# EAGLE design v2 (EAGLE 9.2.0)
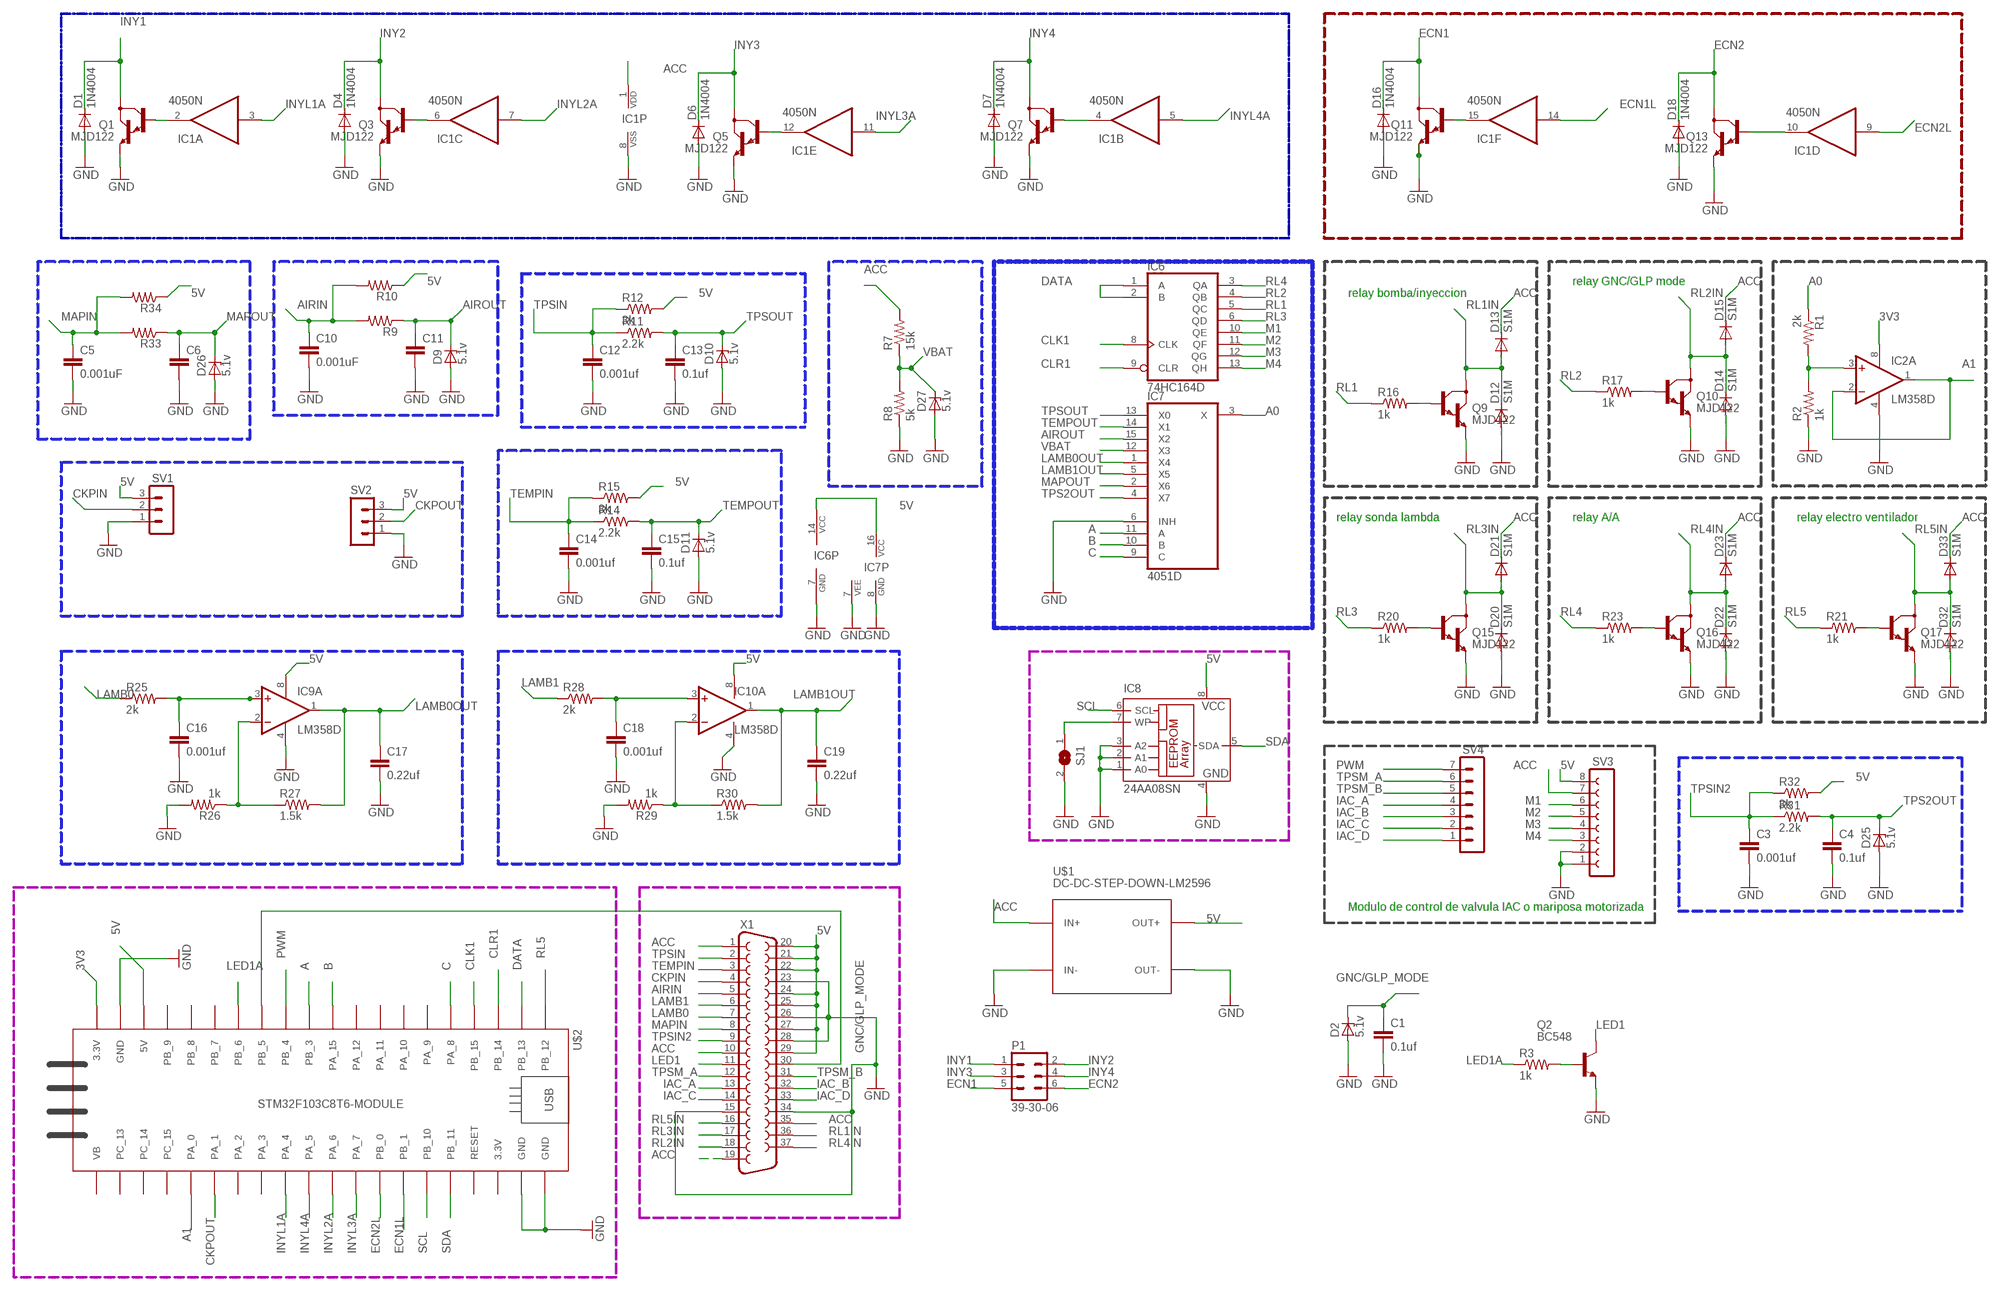
[diagram p0: schematic, sheet 1]

## Parts
C1  0.1uf  C-EU025-025X050  [C025-025X050]
C3  0.001uf  C-EU025-025X050  [C025-025X050]
C4  0.1uf  C-EU025-025X050  [C025-025X050]
C5  0.001uF  C-EU025-025X050  [C025-025X050]
C6  C-EU025-025X050  [C025-025X050]
C10  0.001uF  C-EU025-025X050  [C025-025X050]
C11  C-EU025-025X050  [C025-025X050]
C12  0.001uf  C-EU025-025X050  [C025-025X050]
C13  0.1uf  C-EU025-025X050  [C025-025X050]
C14  0.001uf  C-EU025-025X050  [C025-025X050]
C15  0.1uf  C-EU025-025X050  [C025-025X050]
C16  0.001uf  C-EU025-025X050  [C025-025X050]
C17  0.22uf  C-EU025-025X050  [C025-025X050]
C18  0.001uf  C-EU025-025X050  [C025-025X050]
C19  0.22uf  C-EU025-025X050  [C025-025X050]
D1  1N4004  [DO41-10]
D2  5.1v  ZENER-DIODEZD-5  [ZDIO-5]
D4  1N4004  [DO41-10]
D6  1N4004  [DO41-10]
D7  1N4004  [DO41-10]
D9  5.1v  ZENER-DIODEZD-5  [ZDIO-5]
D10  5.1v  ZENER-DIODEZD-5  [ZDIO-5]
D11  5.1v  ZENER-DIODEZD-5  [ZDIO-5]
D12  S1M  [SMA]
D13  S1M  [SMA]
D14  S1M  [SMA]
D15  S1M  [SMA]
D16  1N4004  [DO41-10]
D18  1N4004  [DO41-10]
D20  S1M  [SMA]
D21  S1M  [SMA]
D22  S1M  [SMA]
D23  S1M  [SMA]
D25  5.1v  ZENER-DIODEZD-5  [ZDIO-5]
D26  5.1v  ZENER-DIODEZD-5  [ZDIO-5]
D27  5.1v  ZENER-DIODEZD-5  [ZDIO-5]
D32  S1M  [SMA]
D33  S1M  [SMA]
IC1  4050N  [DIL16]
IC2  LM358D  [SO08]
IC6  74HC164D  [SO14]
IC7  4051D  [SO16]
IC8  24AA08SN  [SO-08]
IC9  LM358D  [SO08]
IC10  LM358D  [SO08]
P1  39-30-06  [39-30-?06?]
Q1  MJD122  [DPAK]
Q2  BC548  [TO92-EBC]
Q3  MJD122  [DPAK]
Q5  MJD122  [DPAK]
Q7  MJD122  [DPAK]
Q9  MJD122  [DPAK]
Q10  MJD122  [DPAK]
Q11  MJD122  [DPAK]
Q13  MJD122  [DPAK]
Q15  MJD122  [DPAK]
Q16  MJD122  [DPAK]
Q17  MJD122  [DPAK]
R1  2k  R-US_0204/5  [0204/5]
R2  1k  R-US_0204/5  [0204/5]
R3  1k  R-US_0204/5  [0204/5]
R7  15k  R-US_0204/5  [0204/5]
R8  5k  R-US_0204/5  [0204/5]
R9  R-US_0204/5  [0204/5]
R10  R-US_0204/5  [0204/5]
R11  2.2k  R-US_0204/5  [0204/5]
R12  3k  R-US_0204/5  [0204/5]
R14  2.2k  R-US_0204/5  [0204/5]
R15  3k  R-US_0204/5  [0204/5]
R16  1k  R-US_0204/5  [0204/5]
R17  1k  R-US_0204/5  [0204/5]
R20  1k  R-US_0204/5  [0204/5]
R21  1k  R-US_0204/5  [0204/5]
R23  1k  R-US_0204/5  [0204/5]
R25  2k  R-US_0204/5  [0204/5]
R26  1k  R-US_0204/5  [0204/5]
R27  1.5k  R-US_0204/5  [0204/5]
R28  2k  R-US_0204/5  [0204/5]
R29  1k  R-US_0204/5  [0204/5]
R30  1.5k  R-US_0204/5  [0204/5]
R31  2.2k  R-US_0204/5  [0204/5]
R32  3k  R-US_0204/5  [0204/5]
R33  R-US_0204/5  [0204/5]
R34  R-US_0204/5  [0204/5]
SJ1  SJW  [SJW]
SV1  MA03-1  [MA03-1]
SV2  MA03-1  [MA03-1]
SV3  FE08-1  [FE08]
SV4  MA07-1  [MA07-1]
U$1  DC-DC-STEP-DOWN-LM2596  [DC-DC-STEP-DOWN-LM2596]
U$2  STM32F103C8T6-MODULE  [STM32F103C8T6-MODULE]
X1  F37HP  [F37HP]

## Nets
3V3: IC2.8(P:V+) U$2.3.3V_1(3.3V)
5V: IC6.14(VCC) IC7.16(VCC) IC8.8(VCC) IC9.8(P:V+) IC10.8(P:V+) R10.1 R12.2 R15.2 R32.2 R34.1 SV1.3 SV2.3 SV3.8 U$1.OUT+ U$2.5V X1.20 X1.21 X1.22 X1.24 X1.25 X1.27 X1.29
A: IC7.11(A) U$2.PB_3
A0: IC7.3(X) R1.1
A1: IC2.1(A:OUT) IC2.2(A:-IN) U$2.PA_0
ACC: D13.C D15.C D21.C D23.C D33.C IC1.1(P:VDD) R7.2 SV3.7 U$1.IN+ X1.1 X1.10 X1.19 X1.35
AIRIN: C10.1 R9.2 R10.2 X1.5
AIROUT: C11.1 D9.C IC7.15(X2) R9.1
B: IC7.10(B) U$2.PA_15
C: IC7.9(C) U$2.PA_8
CKPIN: SV1.2 X1.4
CKPOUT: SV2.2 U$2.PA_1
CLK1: IC6.8(CLK) U$2.PB_15
CLR1: IC6.9(CLR) U$2.PB_14
DATA: IC6.1(A) IC6.2(B) U$2.PB_13
ECN1: D16.C P1.5 Q11.4(C)
ECN1L: IC1.14(F:I) U$2.PB_1
ECN2: D18.C P1.6 Q13.4(C)
ECN2L: IC1.9(D:I) U$2.PB_0
GNC/GLP_MODE: C1.1 D2.C U$2.PB_5 X1.30
GND: C1.2 C3.2 C4.2 C5.2 C6.2 C10.2 C11.2 C12.2 C13.2 C14.2 C15.2 C16.2 C17.2 C18.2 C19.2 D1.A D2.A D4.A D6.A D7.A D9.A D10.A D11.A D12.A D14.A D16.A D18.A D20.A D22.A D25.A D26.A D27.A D32.A IC1.8(P:VSS) IC2.4(P:V-) IC6.7(GND) IC7.6(INH) IC7.7(VEE) IC7.8(GND) IC8.1(A0) IC8.2(A1) IC8.3(A2) IC8.4(GND) IC9.4(P:V-) IC10.4(P:V-) Q1.3(E) Q2.E Q3.3(E) Q5.3(E) Q7.3(E) Q9.3(E) Q10.3(E) Q11.3(E) Q13.3(E) Q15.3(E) Q16.3(E) Q17.3(E) R2.1 R8.1 R26.2 R29.2 SJ1.2 SV1.1 SV2.1 SV3.1 SV3.2 U$1.IN- U$1.OUT- U$2.GND_1(GND) U$2.GND_2(GND) U$2.GND_3(GND) X1.15 X1.23 X1.26 X1.28 X1.34
IAC_A: SV4.4 X1.13
IAC_B: SV4.3 X1.32
IAC_C: SV4.2 X1.14
IAC_D: SV4.1 X1.33
INY1: D1.C P1.1 Q1.4(C)
INY2: D4.C P1.2 Q3.4(C)
INY3: D6.C P1.3 Q5.4(C)
INY4: D7.C P1.4 Q7.4(C)
INYL1A: IC1.3(A:I) U$2.PA_4
INYL2A: IC1.7(C:I) U$2.PA_6
INYL3A: IC1.11(E:I) U$2.PA_7
INYL4A: IC1.5(B:I) U$2.PA_5
LAMB0: R25.1 X1.7
LAMB0OUT: C17.1 IC7.1(X4) IC9.1(A:OUT) R27.2
LAMB1: R28.1 X1.6
LAMB1OUT: C19.1 IC7.5(X5) IC10.1(A:OUT) R30.2
LED1: Q2.C X1.11
LED1A: R3.1 U$2.PB_6
M1: IC6.10(QE) SV3.6
M2: IC6.11(QF) SV3.5
M3: IC6.12(QG) SV3.4
M4: IC6.13(QH) SV3.3
MAPIN: C5.1 R33.2 R34.2 X1.8
MAPOUT: C6.1 D26.C IC7.2(X6) R33.1
N$1: C18.1 IC10.3(A:+IN) R28.2
N$2: IC1.2(A:O) Q1.1(B)
N$3: IC1.6(C:O) Q3.1(B)
N$4: Q9.1(B) R16.2
N$5: IC1.12(E:O) Q5.1(B)
N$6: IC1.4(B:O) Q7.1(B)
N$7: Q17.1(B) R21.2
N$8: Q10.1(B) R17.2
N$9: IC1.15(F:O) Q11.1(B)
N$10: IC1.10(D:O) Q13.1(B)
N$11: IC2.3(A:+IN) R1.2 R2.2
N$14: Q2.B R3.2
N$19: Q15.1(B) R20.2
N$29: Q16.1(B) R23.2
N$31: C16.1 IC9.3(A:+IN) R25.2
N$32: IC9.2(A:-IN) R26.1 R27.1
N$34: IC8.7(WP) SJ1.1
N$37: IC10.2(A:-IN) R29.1 R30.1
PWM: SV4.7 U$2.PB_4
RL1: IC6.5(QC) R16.1
RL1IN: D12.C D13.A Q9.4(C) X1.36
RL2: IC6.4(QB) R17.1
RL2IN: D14.C D15.A Q10.4(C) X1.18
RL3: IC6.6(QD) R20.1
RL3IN: D20.C D21.A Q15.4(C) X1.17
RL4: IC6.3(QA) R23.1
RL4IN: D22.C D23.A Q16.4(C) X1.37
RL5: R21.1 U$2.PB_12
RL5IN: D32.C D33.A Q17.4(C) X1.16
SCL: IC8.6(SCL) U$2.PB_10
SDA: IC8.5(SDA) U$2.PB_11
TEMPIN: C14.1 R14.1 R15.1 X1.3
TEMPOUT: C15.1 D11.C IC7.14(X1) R14.2
TPS2OUT: C4.1 D25.C IC7.4(X7) R31.2
TPSIN: C12.1 R11.1 R12.1 X1.2
TPSIN2: C3.1 R31.1 R32.1 X1.9
TPSM_A: SV4.6 X1.12
TPSM_B: SV4.5 X1.31
TPSOUT: C13.1 D10.C IC7.13(X0) R11.2
VBAT: D27.C IC7.12(X3) R7.1 R8.2
Unconnected: IC2.5(B:+IN) IC2.6(B:-IN) IC2.7(B:OUT) IC9.5(B:+IN) IC9.6(B:-IN) IC9.7(B:OUT) IC10.5(B:+IN) IC10.6(B:-IN) IC10.7(B:OUT) U$2.3.3V_2(3.3V) U$2.PA_2 U$2.PA_3 U$2.PA_9 U$2.PA_10 U$2.PA_11 U$2.PA_12 U$2.PB_7 U$2.PB_8 U$2.PB_9 U$2.PC_13 U$2.PC_14 U$2.PC_15 U$2.RESET U$2.VB

## Buses
B$1

## Notes on the sheet
- relay GNC/GLP mode
- relay bomba/inyeccion
- relay sonda lambda | relay A/A | relay electro ventilador
- Modulo de control de valvula IAC o mariposa motorizada

## Library data of the parts
C1 C3-C6 C10-C19 = rcl:C-EU: CAPACITOR, European symbol; SPICEPREFIX: C
D1 D4 D6 D7 D16 D18 = diode:1N4004: DIODE general purpose rectifier, 1 A
D2 D9-D11 D25-D27 = diode:ZENER-DIODE: Z-Diode
D12-D15 D20-D23 D32 D33 = diode:S1M
IC1 = 40xx:4050: Hex non-inverting BUFFER
IC2 IC9 IC10 = linear:LM358: OP AMP also LM158; LM258; LM2904 Source: http://cache.national.com/ds/LM/LM158.pdf
IC6 = 74xx-us:74*164: 8-bit parallel out SHIFT REGISTER
IC7 = 40xx:4051: 8-channel ANALOG MULTIPLEXER
IC8 = microchip:24*: Serial EEPROM I2C; MF: MICROCHIP; MPN: 24AA08-I/SN; OC_FARNELL: 1579568; OC_NEWARK: 92C6826
P1 = con-molex-mini-fit:39-30-?06?: HEADER
Q1 Q3 Q5 Q7 Q9-Q11 Q13 Q15-Q17 = MJD122:MJD122: TRANS DARL NPN 100V 5A DPAK; AVAILABILITY: Unavailable; MF: STMicroelectronics; MP: MJD122; PACKAGE: None; PRICE: None
Q2 = transistor-npn:BC548*: NPN Transistor
R1-R3 R7-R12 R14-R17 R20 R21 R23 R25-R34 = rcl:R-US_: RESISTOR, American symbol; SPICEPREFIX: R
SJ1 = jumper:SJ: SMD solder JUMPER
SV1 SV2 = con-lstb:MA03-1: PIN HEADER; OC_FARNELL: unknown; OC_NEWARK: unknown
SV3 = con-lsta:FE08-1: FEMALE HEADER; OC_FARNELL: unknown; OC_NEWARK: unknown
SV4 = con-lstb:MA07-1: PIN HEADER; OC_FARNELL: unknown; OC_NEWARK: unknown
U$1 = diy-modules:DC-DC-STEP-DOWN-LM2596: DC/DC Step-Down Regulator based on LM2596-ADJ chip LM2596 datasheet available here: http://www.ti.com/lit/ds/symlink/lm2596.pdf Click here to find device on ebay.com <http://www.ebay.com/sch/lm2596+power+regulator>
U$2 = stm32f103c8t6_module:STM32F103C8T6-MODULE: STM32F103C8T6 module with ARM Cortex-3, 20kB SRAM, 64kB Flash, 72MHz
X1 = con-subd:F37: SUB-D; OC_FARNELL: unknown; OC_NEWARK: unknown

## Board
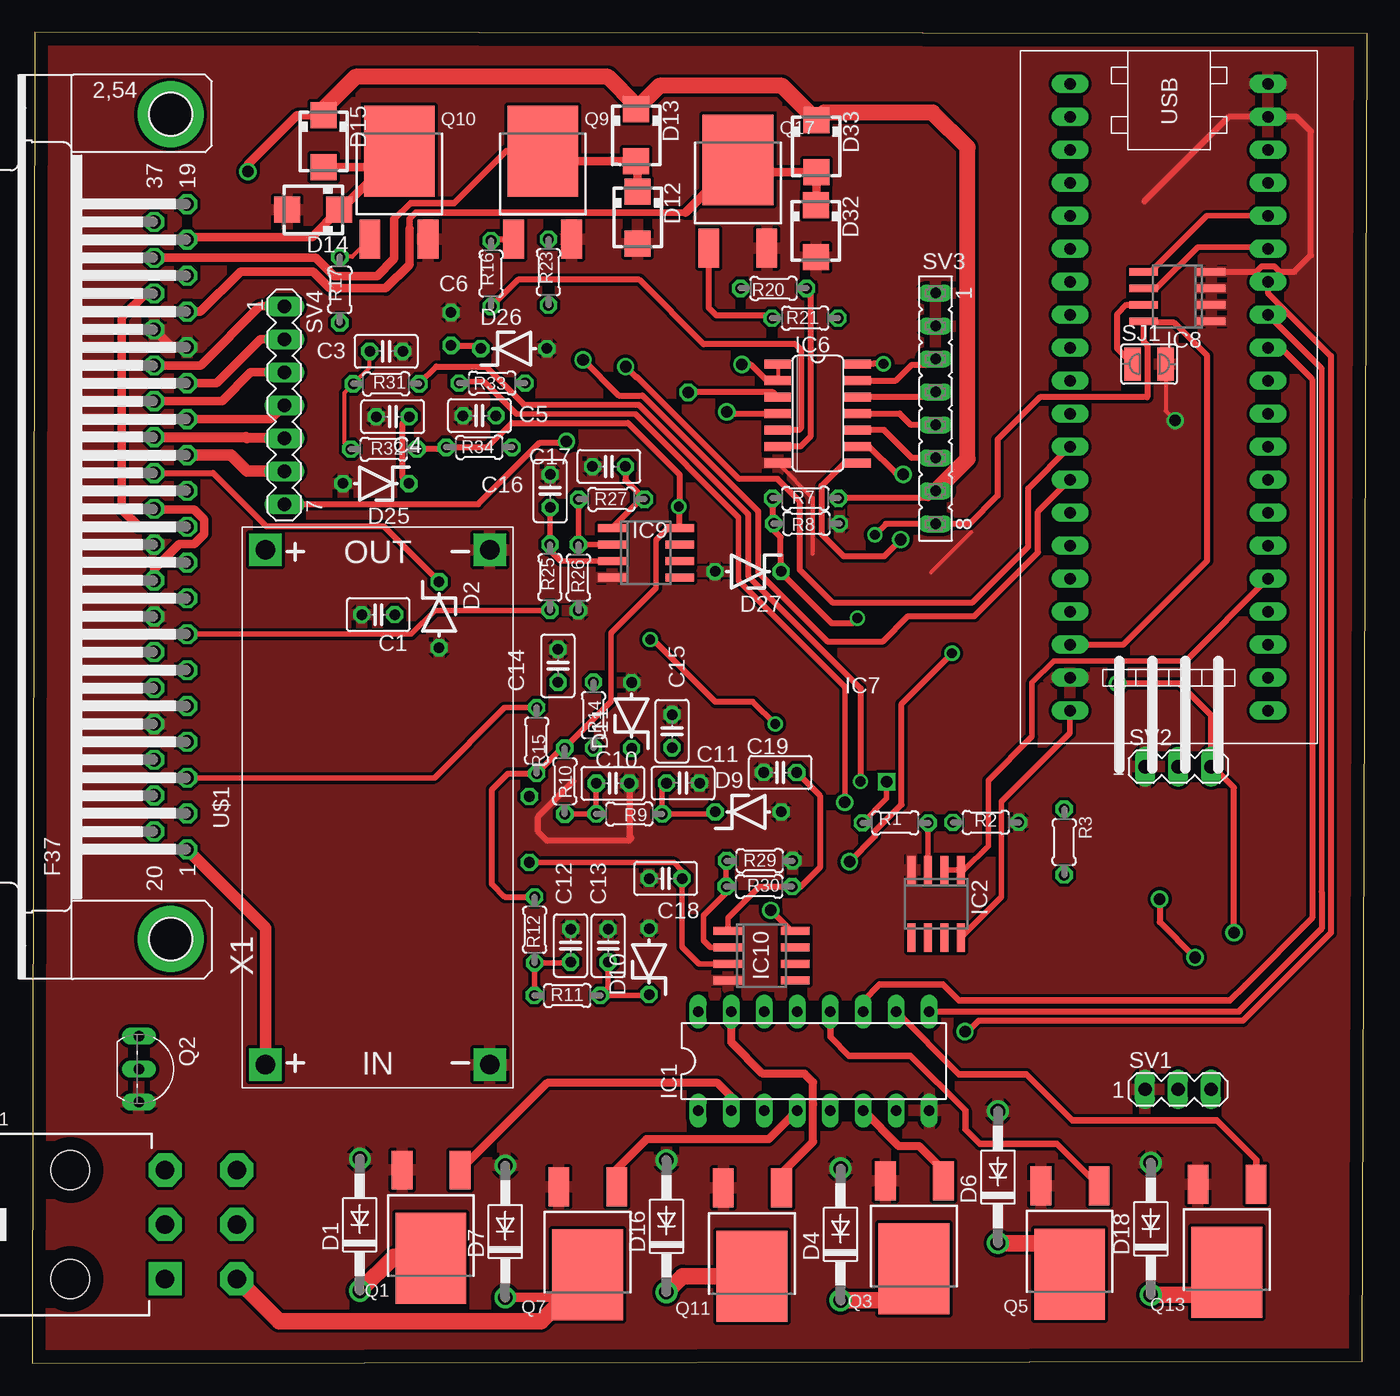
[diagram p1: board, top side]
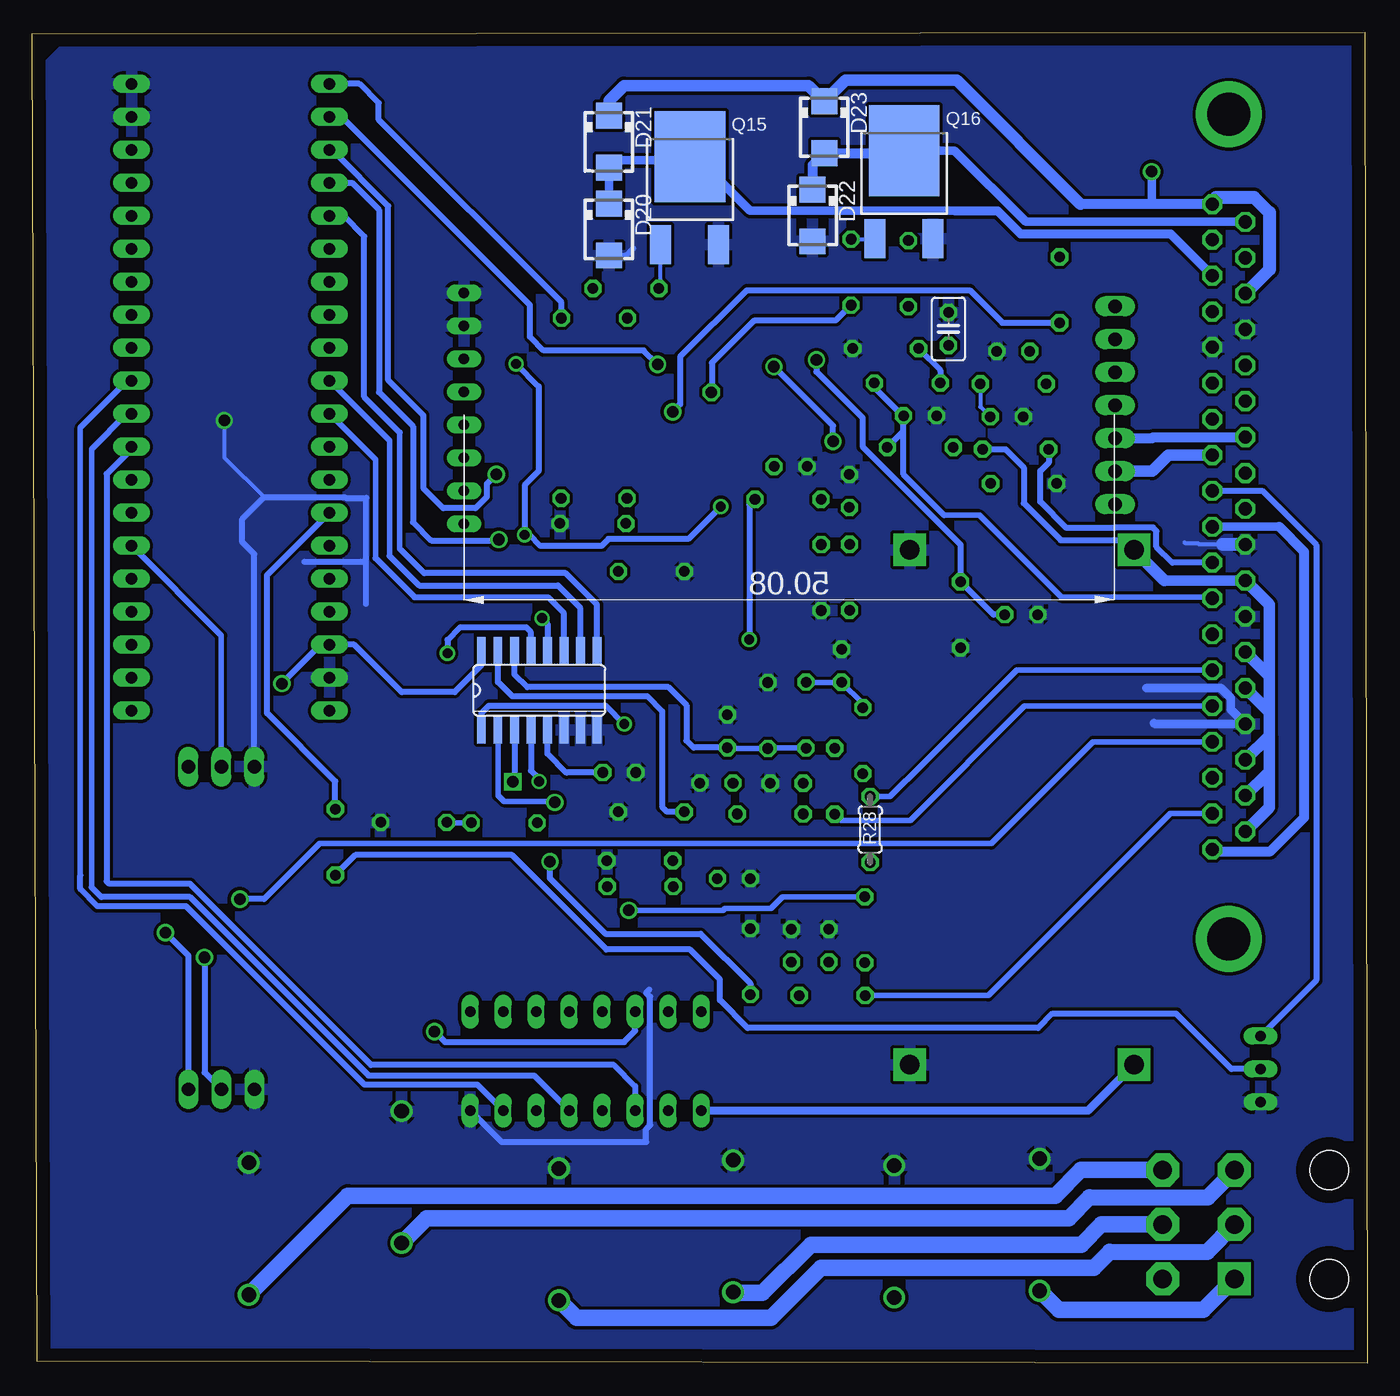
[diagram p2: board, bottom side, seen from below]

Size 102.75 x 102.47 mm. Coordinates in mm from the lower left corner, seen from the top.
Outline: 0,0 102.38,0.16 102.75,102.39 0.17,102.47 0,0
Copper layers (1*16): Top 0.035mm / dielectric 1.5mm / Bottom 0.035mm
Design rules "default *": minimum track width 12mil, minimum drill 0.35mm, track to track 10mil, track to pad 10mil, pad to pad 10mil, via to via 10mil, smd to smd 10mil, copper to edge 40mil, drill to drill 10mil, minimum pad ring 10mil, minimum via ring 8mil, stop-mask expansion 10mil, vias tented up to drill 0mil, thermal gap 10mil

### Footprints (pad centres in the part's own frame; a part is rotated, then mirrored left to right if it is on the bottom)
C025-025X050 = drill 0.813 octagon: 1 -1.27,0; 2 1.27,0
DO41-10 = drill 1.118: A 5.08,0; C -5.08,0
ZDIO-5 = drill 0.813 octagon: A 2.54,0; C -2.54,0
SMA = smd 2 x 2: A 2,0; C -2,0
DIL16 = drill 0.813 long: 1 -8.89,-3.81; 2 -6.35,-3.81; 3 -3.81,-3.81; 4 -1.27,-3.81; 5 1.27,-3.81; 6 3.81,-3.81; 7 6.35,-3.81; 8 8.89,-3.81; 9 8.89,3.81; 10 6.35,3.81; 11 3.81,3.81; 12 1.27,3.81; 13 -1.27,3.81; 14 -3.81,3.81; 15 -6.35,3.81; 16 -8.89,3.81
SO08 = smd 0.6 x 2.2: 1 -1.905,-2.6; 2 -0.635,-2.6; 3 0.635,-2.6; 4 1.905,-2.6; 5 1.905,2.6; 6 0.635,2.6; 7 -0.635,2.6; 8 -1.905,2.6
SO14 = smd 0.66 x 2.032: 1 -3.81,-3.073; 2 -2.54,-3.073; 3 -1.27,-3.073; 4 0,-3.073; 5 1.27,-3.073; 6 2.54,-3.073; 7 3.81,-3.073; 8 3.81,3.073; 9 2.54,3.073; 10 1.27,3.073; 11 0,3.073; 12 -1.27,3.073; 13 -2.54,3.073; 14 -3.81,3.073
SO16 = smd 0.66 x 2.032: 1 -4.445,-3.073; 2 -3.175,-3.073; 3 -1.905,-3.073; 4 -0.635,-3.073; 5 0.635,-3.073; 6 1.905,-3.073; 7 3.175,-3.073; 8 4.445,-3.073; 9 4.445,3.073; 10 3.175,3.073; 11 1.905,3.073; 12 0.635,3.073; 13 -0.635,3.073; 14 -1.905,3.073; 15 -3.175,3.073; 16 -4.445,3.073
SO-08 = smd 0.6 x 2.2: 1 -1.905,-2.6; 2 -0.635,-2.6; 3 0.635,-2.6; 4 1.905,-2.6; 5 1.905,2.6; 6 0.635,2.6; 7 -0.635,2.6; 8 -1.905,2.6
39-30-?06? = drill 1.422 pad 2.54 square: 1 4.191,0 | drill 1.422 pad 2.54 octagon: 2 0,0; 3 -4.191,0; 4 4.191,5.512; 5 0,5.512; 6 -4.191,5.512 | hole 3: -4.191,-7.3; 4.191,-7.3
DPAK = smd 1.6 x 2.997: 1 -2.261,-4.928; 3 2.21,-4.928 | smd 5.452 x 7: 4 0,1.853
TO92-EBC = drill 0.813 long: B 0,-1.27; C -2.54,-1.27; E 2.54,-1.27
0204/5 = drill 0.813 octagon: 1 -2.54,0; 2 2.54,0
SJW = smd 1.27 x 2.54: 1 -1.27,0; 2 1.27,0
MA03-1 = drill 1.016 long: 1 -2.54,0; 2 0,0; 3 2.54,0
FE08 = drill 0.813 long: 1 -8.89,0; 2 -6.35,0; 3 -3.81,0; 4 -1.27,0; 5 1.27,0; 6 3.81,0; 7 6.35,0; 8 8.89,0
MA07-1 = drill 1.016 long: 1 -7.62,0; 2 -5.08,0; 3 -2.54,0; 4 0,0; 5 2.54,0; 6 5.08,0; 7 7.62,0
DC-DC-STEP-DOWN-LM2596 = drill 1.5 pad 2.5 square: IN+ -19.812,8.636; IN- -19.812,-8.636; OUT+ 19.812,8.636; OUT- 19.812,-8.636
STM32F103C8T6-MODULE = drill 0.9 long: 3.3V_1 25.4,-7.62; 3.3V_2 -17.78,7.62; 5V 20.32,-7.62; GND_1 22.86,-7.62; GND_2 -20.32,7.62; GND_3 -22.86,7.62; PA_0 15.24,7.62; PA_1 12.7,7.62; PA_2 10.16,7.62; PA_3 7.62,7.62; PA_4 5.08,7.62; PA_5 2.54,7.62; PA_6 0,7.62; PA_7 -2.54,7.62; PA_8 -12.7,-7.62; PA_9 -10.16,-7.62; PA_10 -7.62,-7.62; PA_11 -5.08,-7.62; PA_12 -2.54,-7.62; PA_15 0,-7.62; PB_0 -5.08,7.62; PB_1 -7.62,7.62; PB_3 2.54,-7.62; PB_4 5.08,-7.62; PB_5 7.62,-7.62; PB_6 10.16,-7.62; PB_7 12.7,-7.62; PB_8 15.24,-7.62; PB_9 17.78,-7.62; PB_10 -10.16,7.62; PB_11 -12.7,7.62; PB_12 -22.86,-7.62; PB_13 -20.32,-7.62; PB_14 -17.78,-7.62; PB_15 -15.24,-7.62; PC_13 22.86,7.62; PC_14 20.32,7.62; PC_15 17.78,7.62; RESET -15.24,7.62; VB 25.4,7.62
F37HP = drill 1.016 octagon: 1 -24.841,-1.27; 2 -22.073,-1.27; 3 -19.329,-1.27; 4 -16.561,-1.27; 5 -13.792,-1.27; 6 -11.049,-1.27; 7 -8.28,-1.27; 8 -5.512,-1.27; 9 -2.769,-1.27; 10 0,-1.27; 11 2.769,-1.27; 12 5.512,-1.27; 13 8.28,-1.27; 14 11.049,-1.27; 15 13.818,-1.27; 16 16.561,-1.27; 17 19.329,-1.27; 18 22.098,-1.27; 19 24.841,-1.27; 20 -23.47,1.27; 21 -20.701,1.27; 22 -17.932,1.27; 23 -15.189,1.27; 24 -12.421,1.27; 25 -9.652,1.27; 26 -6.909,1.27; 27 -4.14,1.27; 28 -1.372,1.27; 29 1.372,1.27; 30 4.14,1.27; 31 6.909,1.27; 32 9.677,1.27; 33 12.421,1.27; 34 15.189,1.27; 35 17.958,1.27; 36 20.701,1.27; 37 23.47,1.27 | drill 3.302 pad 5.08: G1 -31.75,0; G2 31.75,0

### Placement (x,y rotation side)
C1  26.62,57.65 180 top
C3  27.23,77.92 0 top
C4  27.73,72.89 180 top
C5  34.42,72.97 180 top
C6  32.22,79.65 90 bottom
C10  44.68,44.67 0 top
C11  50.09,44.68 0 top
C12  41.43,32.17 90 top
C13  44.33,32.16 90 top
C14  40.46,53.71 90 top
C15  49.25,48.68 90 top
C16  39.86,67.17 90 top
C17  44.38,69.06 180 top
C18  48.75,37.34 180 top
C19  57.57,45.5 180 top
D1  25.2,10.67 90 top
D2  31.3,57.64 270 top
D4  62.21,9.94 90 top
D6  74.33,14.34 90 top
D7  36.4,10.16 90 top
D9  55.11,42.47 0 top
D10  47.48,30.94 90 top
D11  46.13,49.88 90 top
D12  46.6,88.22 270 top
D13  46.48,94.56 270 top
D14  21.62,88.81 180 top
D15  22.42,94.09 270 top
D16  48.81,10.56 90 top
D18  86.1,10.37 90 top
D20  58.37,87.31 270 bottom
D21  58.37,94.06 270 bottom
D22  42.69,88.38 270 bottom
D23  41.78,95.18 270 bottom
D25  26.44,67.74 180 top
D26  37.06,78.14 0 top
D27  55.1,60.97 180 top
D32  60.32,87.19 270 top
D33  60.36,93.71 270 top
IC1  60.15,23.28 0 top
IC2  69.58,35.39 180 top
IC6  60.46,73.13 270 top
IC7  63.73,51.83 0 bottom
IC8  88.14,82.13 90 top
IC9  47.23,62.41 270 top
IC10  56.13,31.39 270 top
P1  39-30-06?  [39-30-?06?]  10.21,10.69 270 top
Q1  30.67,9.96 180 top
Q2  9.46,22.67 270 top
Q3  67.87,9.12 180 top
Q5  79.85,8.73 180 top
Q7  42.73,8.68 180 top
Q9  39.3,91.49 0 top
Q10  28.24,91.48 0 top
Q11  55.4,8.58 180 top
Q13  91.95,8.87 180 top
Q15  52.13,91.06 0 bottom
Q16  35.63,91.51 0 bottom
Q17  54.32,90.8 0 top
R1  66.43,41.62 0 top
R2  73.4,41.65 180 top
R3  79.43,40.14 270 top
R7  59.51,66.61 0 top
R8  59.59,64.67 180 top
R9  45.95,42.3 180 top
R10  40.98,44.83 270 top
R11  41.18,28.33 0 top
R12  38.66,33.39 90 top
R14  43.19,49.92 270 top
R15  38.82,47.95 270 top
R16  35.31,83.91 90 top
R17  23.67,82.65 90 top
R20  57.06,82.77 180 top
R21  59.49,80.48 180 top
R23  39.73,84.02 90 top
R25  39.84,60.52 90 top
R26  42.02,60.51 270 top
R27  44.58,66.53 0 top
R28  38.26,41.11 270 bottom
R29  55.99,38.71 0 top
R30  55.95,36.72 0 top
R31  27.23,75.42 0 top
R32  27.05,70.39 0 top
R33  35.4,75.48 0 top
R34  34.4,70.53 0 top
SJ1  85.98,76.94 0 top
SV1  88.2,21.09 0 top
SV2  88.21,45.94 0 top
SV3  69.52,73.52 270 top
SV4  19.39,73.77 270 top
U$1  26.57,42.81 90 top
U$2  87.5,75.66 270 top
X1  10.64,64.42 90 top

### Tracks (layer width: path | path; a pad name or v marks a point on that pad's centre or on a via)
3V3
  Top 0.406: U$2.3.3V_1 79.88,48.53 74.61,43.26 74.61,35.91 IC2.8
5V  (via drill 0.76, 0.89)
  Top 0.406: R15.2 40.77,47.37 R10.1 44.56,50.95 44.56,56.22 48.02,59.68 48.02,63.39 48.95,64.32 IC9.8 | IC10.8 58.42,33.3 v56.84,34.88
  Top 0.457: R32.2 31.71,70.39 R34.1 35.05,70.53 36.92,72.4 45.85,72.4 49.83,68.43 49.83,65.9 | IC9.8 49.83,65.9 | 49.83,65.9 v49.75,65.97 | v65.52,76.96 64.74,76.96 64.72,76.94 IC6.14 | v64.86,63.8 65.7,64.63 SV3.8 72.12,64.63 74.31,66.81 74.31,71.15 77.55,74.39 85.83,74.39 85.83,78.41 85.54,78.7 85.54,80.13 | IC8.8 85.54,80.13 | U$2.5V 83.98,55.34 90.45,61.8 90.45,77.59 87.91,80.13 85.54,80.13 | SV2.3 90.75,46.08 | 90.75,46.08 90.75,49.88 88.28,52.34 v83.55,52.34 | v92.51,33.15 92.51,44.33 90.75,46.08 | R12.2 36.36,35.93 35.38,36.9 35.38,44.18 36.61,45.41 R15.2
  Top 0.635: X1.27 9.37,61.16 11.29,63.09 12.46,63.09 13.24,63.87 13.24,64.97 12.46,65.75 9.4,65.75 X1.29
  Bottom 0.406: R12.2 45,35.93 45.9,35.03 49.44,35.03 49.57,34.89 56.83,34.89 v56.84,34.88
  Bottom 0.457: R32.2 27.84,70.39 26.43,68.98 26.43,66.23 23.58,63.38 18.69,63.38 U$1.OUT+ | v65.52,76.96 63.77,75.21 63.77,68.71 64.86,67.61 v64.86,63.8 64.48,63.8 63.65,62.96 58.91,62.96 58.4,63.48 52.25,63.48 v49.75,65.97 | IC7.16 68.17,53.76 70.25,51.69 74.32,51.69 77.97,55.34 U$2.5V 80.55,55.34 v83.55,52.34 | SV1.3 90.74,31.39 v92.51,33.15
  Bottom 0.813: 15.59,60.28 X1.27
  Bottom 0.889: 15.59,60.28 U$1.OUT+ | X1.22 7.53,48.32 | 7.53,50.16 X1.24 | 7.53,48.32 7.53,50.16 | 7.53,50.16 7.53,52.93 | 7.53,52.93 X1.25 | 7.53,48.32 7.53,45.55 | 7.53,45.55 X1.21 | 7.53,45.55 7.53,42.79 X1.20 | 7.53,52.93 7.53,58.44 X1.27
A
  Bottom 0.406: U$2.PB_3 76.34,69.57 76.34,62
  Bottom 0.457: IC7.11 61.82,57.76 63.07,59 73.34,59 76.34,62
A0  (via drill 0.89)
  Top 0.406: R1.1 65.76,43.49 v65.76,44.78
  Bottom 0.457: v65.76,44.78 65.63,44.91 IC7.3
A1
  Top 0.406: IC2.2 IC2.1 71.73,37.99 73.58,39.84 73.58,44.89 76.96,48.26 76.96,52.42 78.63,54.09 88.79,54.09 U$2.PA_0
ACC  (via drill 0.89)
  Top 0.457: SV3.7 68.96,66.61 R7.2
  Top 0.635: D15.C 20.4,96.09 16.58,92.28 v16.58,91.76 | X1.35 8.72,82.38 6.88,80.54 6.88,65.76 8.21,64.42 X1.10
  Top 0.889: X1.1 17.94,33.54 U$1.IN+
  Top 1.219: D15.C 22.42,96.59 24.87,99.05 44.31,99.05 46.48,96.88 D13.C 48.28,98.36 57.71,98.36 D33.C 60.95,96.31 69.3,96.31 71.98,93.63 71.98,69.63 SV3.7
  Bottom 0.457: X1.19 11.62,89.55 11.62,89.79
  Bottom 0.61: IC1.1 21.47,19.47 U$1.IN+
  Bottom 0.635: 11.75,39.42 X1.1 | v16.58,91.76 16.58,89.3 16.62,89.26 | 6.77,64.42 X1.10
  Bottom 0.762: X1.19 16.62,89.26 22.05,89.26 | 11.75,39.42 7.43,39.42 4.83,42.02 4.83,62.48 6.77,64.42
  Bottom 0.889: D21.C 58.37,97.23 57.21,98.39 42.99,98.39 D23.C 40.17,98.79 31.59,98.79 22.05,89.26
  Bottom 1.016: 11.62,89.79 8.71,89.79 7.52,88.6 7.52,84.22 X1.35
AIRIN
  Top 0.406: R10.2 43.39,42.29 R9.2 C10.1
  Bottom 0.406: X1.5 26.37,50.63 35.17,41.82 40.51,41.82 R10.2
AIROUT
  Top 0.406: C11.1 48.49,44.35 R9.1 52.4,42.3 D9.C
  Bottom 0.457: IC7.15 66.9,52.45 65.8,51.35 55.4,51.35 54.26,50.21 54.26,42.85 53.89,42.47 D9.C
B
  Bottom 0.406: 75.27,62.17 75.27,71.04 U$2.PA_15
  Bottom 0.457: IC7.10 60.55,58.15 62.3,59.89 72.99,59.89 75.27,62.17
C
  Bottom 0.406: 74.47,71.67 74.47,62.73
  Bottom 0.457: IC7.9 59.28,58.43 61.71,60.85 72.59,60.85 74.47,62.73 | 74.47,71.67 77.2,74.4 77.2,86.75 78.81,88.36 U$2.PA_8
CKPIN  (via drill 0.89)
  Top 0.457: v86.78,35.75 86.78,33.98 v89.5,31.26
  Bottom 0.406: X1.4 21.1,47.86 28.94,40.02 80.65,40.02
  Bottom 0.457: 80.65,40.02 84.92,35.75 v86.78,35.75 | v89.5,31.26 89.5,22.4 SV1.2
CKPOUT
  Bottom 0.406: SV2.2 88.21,56.04 U$2.PA_1
CLK1  (via drill 0.89)
  Top 0.457: IC6.8 62.5,69.32 60.73,67.55 60.73,63.87 62.46,62.14 65.56,62.14 v66.85,63.43
  Bottom 0.457: v66.85,63.43 66.93,63.36 72.04,63.36 73.45,64.76 73.45,72.16 76.07,74.78 76.07,88.81 78.16,90.9 U$2.PB_15
CLR1  (via drill 0.89)
  Top 0.457: IC6.9 64.41,70.59 66.43,68.57 66.91,68.57 v67.02,68.45
  Bottom 0.457: U$2.PB_14 79.69,93.44 75.36,89.11 75.36,75.7 72.66,73 72.66,67.4 71.12,65.85 68.63,65.85 67.77,66.72 67.77,67.71 v67.02,68.45
DATA  (via drill 0.89)
  Top 0.305: IC6.2 IC6.1 57.39,75.9 56.32,75.9 55.33,76.88
  Top 0.457: IC6.2 56.54,75.67 55.33,76.88 54.66,76.88 v54.62,76.93
  Bottom 0.457: v54.62,76.93 55.69,77.99 63.39,77.99 64.44,79.04 64.44,81.49 78.93,95.98 U$2.PB_13
ECN1
  Top 1.27: D16.C 50.06,6.72 Q11.4
  Bottom 1.27: P1.5 20.45,10.7 22,9.14 42.82,9.14 46.53,5.44 48.77,5.44 D16.C
ECN1L  (via drill 0.89)
  Top 0.457: U$2.PB_1 95.12,82.42 99.97,77.57 99.97,33.16 93.18,26.38 72.84,26.38 71.9,25.44 v71.79,25.55
  Bottom 0.457: v71.79,25.55 70.99,24.75 57.2,24.75 56.34,25.61 IC1.14
ECN2
  Top 1.27: D18.C 90.22,5.29 Q13.4
  Bottom 1.27: P1.6 22.02,14.89 24,12.91 78.47,12.91 D18.C
ECN2L
  Top 0.406: U$2.PB_0 99.26,76.6 99.26,36.32
  Top 0.457: IC1.9 92.89,27.09 99.2,33.4 99.26,33.46 99.26,36.32
GNC/GLP_MODE  (via drill 0.89)
  Top 0.457: U$2.PB_5 77.42,65.57 77.42,62.43 72.51,57.53 67.41,57.53 65.48,55.6 61.19,55.6 55.87,60.91 55.87,65.61 46.96,74.52 45.13,74.52 v42.39,77.27 | X1.30 13.9,68.56 18,64.46 27.02,64.46 D2.C
  Bottom 0.457: v42.39,77.27 42.39,76.35 38.84,72.8 38.84,70.59 31.3,63.04 D2.C 28.76,57.65 C1.1
GND  (via drill 0.89)
  Top 0.305: 87.36,76.83 SJ1.2 87.25,73.33 v87.99,72.59 | IC6.7 60.07,66.64 60.07,62.34 | 69.18,60.9 72.28,64
  Top 0.457: D32.A 61.03,84.48 | C10.2 45.95,40.6 46.12,40.44 45.92,40.24 39.63,40.24 38.93,40.94 38.93,42.11 41.63,44.81 | IC8.4 94.21,84.04 94.63,84.46 95.62,84.46 96.04,84.04 97.16,84.04 98.43,85.31 98.43,94.82 98.45,94.84 97.31,95.98 U$2.GND_2 92.11,95.98 85.61,89.48
  Top 0.635: X1.34 10.74,78.24 X1.15
  Bottom 0.305: 14.06,63.22 14.05,63.22 13.97,63.14 13.01,63.14 12.92,63.05 10.36,63.05 | v87.99,72.59 87.99,69.75 84.92,66.68
  Bottom 0.457: D20.A 57.05,85.31 56.5,85.86 | IC1.8 66.62,17.04 55.5,17.04 55.5,18.03 55.2,18.33 55.2,28.22 55.5,28.52 55.5,28.54 55.25,28.79 | SV2.1 85.67,62.3 86.59,63.22 86.59,65.01 84.92,66.68 78.69,66.68 78.64,66.63 77.03,66.63 77.1,66.56 77.1,61.8 | 77.1,61.8 77.1,58.49 | 77.1,61.8 77.2,61.7 81.83,61.7
  Bottom 0.635: 16.41,49.31 16.33,49.23 X1.23 10.5,50.36 10.5,51.24 11.24,51.99 16.98,51.99
  Bottom 1.016: X1.28 10.36,63.05 11.11,63.05 11.12,63.05
  pour Top: 0.56,102.42 0.56,0.76 102.04,0.76 102.04,101.91 101.54,102.42
  pour Bottom: 0.16,101.68 99.76,101.68 101.98,99.45 101.98,0.61 0.16,0.61
IAC_A
  Top 0.635: X1.13 18.33,72.7 SV4.4
IAC_B
  Top 0.635: X1.32 14.61,74.1 16.82,76.31 SV4.3
IAC_C
  Top 0.635: X1.14 14.2,75.47 17.58,78.85 SV4.2
IAC_D
  Top 0.635: X1.33 12.94,76.84 17.49,81.39 SV4.1
INY1
  Top 0.889: Q1.4 27.95,8.11 27.83,8.23
  Top 1.219: 27.83,8.23 D1.C
  Bottom 1.27: P1.1 12.6,4.12 23.74,4.12 25.2,5.58 D1.C
INY2
  Top 0.889: Q3.4 65.46,4.86
  Top 1.27: 65.46,4.86 D4.C
  Bottom 1.219: 19.81,8.6 12.31,8.6
  Bottom 1.27: P1.2 12.31,8.6 | 19.81,8.6 21.03,7.38 42.04,7.38 45.91,3.51 60.87,3.51 D4.C
INY3
  Top 1.27: Q5.4 77.47,9.26 D6.C
  Bottom 1.219: 21.36,12.78 12.28,12.78
  Bottom 1.27: 12.28,12.78 10.21,14.85 P1.3 | D6.C 72.4,11.19 22.96,11.19 21.36,12.78
INY4
  Top 0.762: D7.C 40.94,5.04 Q7.4
  Top 1.219: 18.98,3.25 P1.4
  Top 1.27: Q7.4 39.15,3.25 18.98,3.25
INYL1A
  Bottom 0.406: U$2.PA_4 95.12,70.38 97.03,68.48
  Bottom 0.457: IC1.3 56.34,21.34 57.98,22.98 76.68,22.98 90.62,36.92 96.84,36.92 97.03,37.12 97.03,68.48
INYL2A
  Bottom 0.406: U$2.PA_6 95.45,75.66 99.06,72.04 99.06,37.58
  Bottom 0.457: IC1.7 68.49,21.46 77.19,21.46 90.93,35.2 97.75,35.2 99.06,36.51 99.06,37.58
INYL3A
  Top 0.457: U$2.PA_7 96.11,78.2 98.53,75.78 98.53,34.29 93.36,29.12
  Top 0.508: IC1.11 63.96,27.92 65.21,29.17 70.1,29.17 71.32,27.95 92.19,27.95 93.36,29.12
INYL4A
  Bottom 0.406: U$2.PA_5 95.48,73.12 98.2,70.4 98.2,36.66
  Bottom 0.457: IC1.5 64.12,22.17 76.87,22.17 90.61,35.91 97.45,35.91 98.2,36.66
LAMB0
  Top 0.406: X1.7 29.16,56.14 31,57.98 R25.1
LAMB0OUT  (via drill 0.76)
  Top 0.457: C17.1 45.65,68 R27.2 46.84,66.53 IC9.1 | v57.19,49.23 55.47,50.94 52.58,50.94 47.79,55.73 v47.56,55.73
  Bottom 0.457: IC7.1 68.17,50.06 67.6,50.64 58.59,50.64 v57.19,49.23 | R27.2 47.56,66.09 v47.56,55.73
LAMB1
  Bottom 0.406: X1.6 26.96,53.37 34.15,46.18 36.72,43.64 R28.1
LAMB1OUT
  Top 0.406: 55.97,36.72 53.53,34.28 IC10.1
  Top 0.457: 55.97,36.72 R30.2 59.16,36.72 60.61,38.17 60.61,43.73 C19.1
  Bottom 0.457: IC7.5 63.09,46.94 61.62,45.47 61.6,45.5 C19.1
LED1
  Bottom 0.457: X1.11 8.07,67.19 3.92,63.03 3.92,29.49 Q2.C
LED1A
  Bottom 0.457: R3.1 79.43,44.81 84.7,50.08 84.7,60.69 U$2.PB_6
M1
  Top 0.457: SV3.6 67.71,69.71 65.56,71.86 IC6.10
M2
  Top 0.457: IC6.11 66.76,73.13 67.64,72.25 SV3.5
M3
  Top 0.457: IC6.12 69.13,74.4 SV3.4
M4
  Top 0.457: IC6.13 66.48,75.67 67.7,76.89 69.08,76.89 SV3.3
MAPIN
  Bottom 0.406: X1.8 12.01,59.01 23.55,59.01 29.85,65.31 32.56,65.31 | R34.2 35.69,71.78 C5.1 35.78,72.97 37.94,75.13 R33.2
  Bottom 0.457: C5.1 35.69,68.44 32.56,65.31
MAPOUT  (via drill 0.89)
  Top 0.406: R33.1 32.95,75.58 34.77,75.58 37.26,73.09 46.42,73.09 54.37,65.14 54.37,60.26 62.55,52.08 v62.55,43.19
  Top 0.457: C6.1 34.28,78.38 D26.C
  Bottom 0.406: v62.55,43.19 62.63,43.28 66.45,43.28 66.9,43.73 IC7.2
  Bottom 0.457: D26.C 32.86,76.47 R33.1
N$1
  Top 0.406: IC10.3 51.31,30.76 50.02,32.05 C18.1 50.02,37.93 49.37,38.57 R28.2
N$2
  Top 0.61: IC1.2 53.8,20.53 52.74,21.58 39.62,21.58 Q1.1
N$3
  Top 0.61: IC1.6 66.68,16.75 68.26,16.75 70.13,14.88 Q3.1
N$4
  Top 0.457: R16.2 35.42,86.56 Q9.1
N$5
  Top 0.508: IC1.12 61.42,25.13 62.86,23.69 67.59,23.69 71.81,19.47 71.81,18.04 72.95,16.9 78.88,16.9 Q5.1
N$6
  Top 0.61: Q7.1 44.84,13.46 44.84,14.83 47.27,17.26 56.67,17.26 IC1.4
N$7
  Top 0.457: R21.2 56.72,80.71 52.64,80.71 52.06,81.29 Q17.1
N$8
  Top 0.305: R17.2 24.62,85.19 Q10.1
N$9
  Top 0.61: Q11.1 57.66,14.62 60.1,17.07 60.1,19.97 60.09,19.98 60.09,21.66 59.44,22.31 56.22,22.31 53.8,24.73 IC1.15
N$10
  Top 0.457: IC1.10 71.34,22.24
  Top 0.508: 71.34,22.24 76.53,22.24 80.07,18.7 91.19,18.7 94.21,15.68 Q13.1
N$11
  Top 0.406: IC2.3 68.95,41.6 R1.2
  Bottom 0.406: R1.2 70.82,41.62 R2.2
N$14
  Bottom 0.457: 14.69,26.93 | 14.69,26.93 10.43,22.67 Q2.B | 14.69,26.93 24.21,26.93 25.31,25.83 47.69,25.83 49.83,27.97 49.83,29.58 52.12,31.87 58.56,31.87 65.82,39.14 77.89,39.14 R3.2
N$19
  Bottom 0.305: Q15.1 54.42,86.11 54.42,82.86 R20.2
N$29
  Bottom 0.305: R23.2 37.92,86.56 Q16.1
N$31
  Top 0.406: IC9.3 40.66,61.78 39.84,62.6 R25.2 39.86,63.08 C16.1
N$32
  Top 0.406: IC9.2 R26.1 | R26.1 | R26.1 42.04,63.06 R27.1
N$34
  Top 0.457: SJ1.1 83.51,78.14 83.51,80.78 84.24,81.5 IC8.7
N$37
  Top 0.406: IC10.2 52.21,32.03 51.66,32.58 51.66,34.48 53.41,36.23 R30.1 53.41,38.67 R29.1
PWM  (via drill 0.89)
  Top 0.457: SV4.7 34.32,66.15 39.06,70.89 41.03,70.89 v41.12,70.98 | v45.66,76.75 46.48,75.93 46.52,75.97 54.4,68.09 57.36,68.09 59.07,66.38 59.07,61.11 61.58,58.6 72.38,58.6 76.67,62.88 76.67,67.36 U$2.PB_4
  Bottom 0.457: v41.12,70.98 41.12,72.2 v45.66,76.75
RL1
  Top 0.457: R16.1 37.37,83.43 46.72,83.43 51.68,78.48 58.74,78.48 59.16,78.05 59.16,72 59.02,71.86 IC6.5
RL1IN
  Top 0.508: Q9.4 36.47,93.34 32.46,89.33 29.11,89.33 27.86,88.08
  Top 0.635: Q9.4 40.08,92.56 D13.A 46.6,92.44 D12.C | X1.36 21.82,85.12 23.21,83.72 26.53,83.72 27.86,85.05 27.86,88.08
RL2  (via drill 0.89)
  Top 0.457: v53.46,73.27 53.64,73.09 57.35,73.09 IC6.4
  Bottom 0.457: R17.1 28.08,80.12 30.58,82.62 47.75,82.62 52.88,77.5 52.88,73.86 v53.46,73.27
RL2IN
  Top 0.457: 27,92.09 Q10.4 26.94,92.03
  Top 0.635: 26.94,92.03 23.73,88.81 D14.C 21.53,86.72 12.11,86.72 X1.18 | 27,92.09 D15.A
RL3
  Top 0.457: R20.1 59.6,82.62 59.89,82.33 59.89,71.35 59.13,70.6 IC6.6
RL3IN
  Bottom 0.635: D20.C D21.A 57.78,92.65 52.58,92.65 52.31,92.92 Q15.4 51.68,92.92 47.5,88.74 31.71,88.74 | X1.17 14.11,85.95
  Bottom 0.711: 14.11,85.95 15.12,86.96 26.67,86.96 28.44,88.74 31.71,88.74
RL4  (via drill 0.89)
  Top 0.457: v50.48,74.77 57.02,74.77 IC6.3
  Bottom 0.457: v50.48,74.77 50.43,74.82 50.43,77.03 47.15,80.31 40.89,80.31 R23.1
RL4IN
  Bottom 0.635: Q16.4 31.76,93.37 26.28,87.89 X1.37
  Bottom 0.762: Q16.4 35.82,93.18 D23.A 42.69,92.27 D22.C
RL5
  Bottom 0.457: R21.1 62.03,81.69 76.09,95.75 76.09,97.04 77.56,98.52 U$2.PB_12
RL5IN
  Top 0.483: 29.03,88.15 29.48,88.6 50.27,88.6
  Top 0.508: 29.03,87.37 29.03,88.15
  Top 0.635: D32.C 60.36,89.23 D33.A 55.27,91.71 Q17.4 50.27,88.6 | X1.16 12.93,80.98 16.01,84.06 21.61,84.06 22.9,82.78 27.2,82.78 29.03,84.61 29.03,87.37
SCL
  Top 0.406: U$2.PB_10 94.99,85.95 89.71,85.95 89.7,85.96 86.51,82.77 IC8.6
SDA
  Top 0.406: IC8.5 86.09,84.04 90.41,88.36 U$2.PB_11
TEMPIN
  Top 0.406: X1.3 30.94,45.09 36.34,50.49 R15.1
  Bottom 0.406: R14.1 43.17,52.44 C14.1 38.82,50.8 R15.1
TEMPOUT
  Bottom 0.406: R14.2 46.09,47.38 D11.C 49.18,47.34 C15.1
  Bottom 0.457: IC7.14 65.63,53.05 64.64,52.06 58.75,52.06 58.74,52.07 53.78,52.07 52.4,50.69 52.4,47.96 51.85,47.41 C15.1
TPS2OUT  (via drill 0.76)
  Top 0.457: v63.75,44.79 63.75,51.98 55.11,60.63 55.11,65.37 46.67,73.81 37.82,73.81 37.82,73.85 34.93,76.75 31.1,76.75 R31.2 | C4.1 28.46,72.35 28.46,68.26 D25.C
  Bottom 0.305: C4.1 29.77,73.66 R31.2
  Bottom 0.457: IC7.4 64.36,45.63 63.75,45.02 v63.75,44.79
TPSIN
  Top 0.406: R11.1 38.64,30.82 R12.1 41.38,30.85 C12.1
  Bottom 0.406: X1.2 15.13,42.35 29.15,28.33 R11.1
TPSIN2
  Top 0.305: R32.1 24,70.9 24,74.72 R31.1 25.96,76.69 C3.1
  Bottom 0.457: X1.9 14.98,61.65 16.21,62.87 16.21,64.08 16.49,64.36 19.39,64.36 19.43,64.32 23.14,64.32 25.16,66.34 25.16,68.7 24.51,69.35 R32.1
TPSM_A
  Top 0.889: X1.12 15.29,69.93 16.54,68.69 SV4.6
  Bottom 0.889: X1.12 15.29,69.93 16.54,68.69 SV4.6
TPSM_B
  Top 0.762: X1.31 16.42,71.33 16.52,71.23 SV4.5
  Bottom 0.762: SV4.5 16.54,71.23 16.45,71.31 9.38,71.31 X1.31
TPSOUT  (via drill 0.76, 0.89)
  Top 0.406: D10.C 47.4,28.33 R11.2 44.33,28.94 C13.1
  Top 0.457: v62.9,38.63 64.87,40.59 64.87,40.99 66.91,43.03 66.91,50.78 v70.8,54.67
  Bottom 0.457: v70.8,54.67 70.8,55.71 69.82,56.69 64.74,56.69 64.4,56.35 64.4,54.95 IC7.13 | D10.C 47.48,29.26 51.3,33.09 58.64,33.09 62.9,37.36 v62.9,38.63
VBAT  (via drill 0.76)
  Top 0.457: R7.1 56.97,64.75 R8.2 57.05,64.17 57.6,63.62 D27.C 57.64,60.89 61.52,57 63.13,57 v63.51,57.38
  Bottom 0.457: v63.51,57.38 63.09,56.96 IC7.12